# Altium schematic sheet Модуль MMI.SchDoc
size 209 x 297 mm; DocumentNumber: 6; SheetNumber: 6; SheetTotal: 11; ListNumber: 1
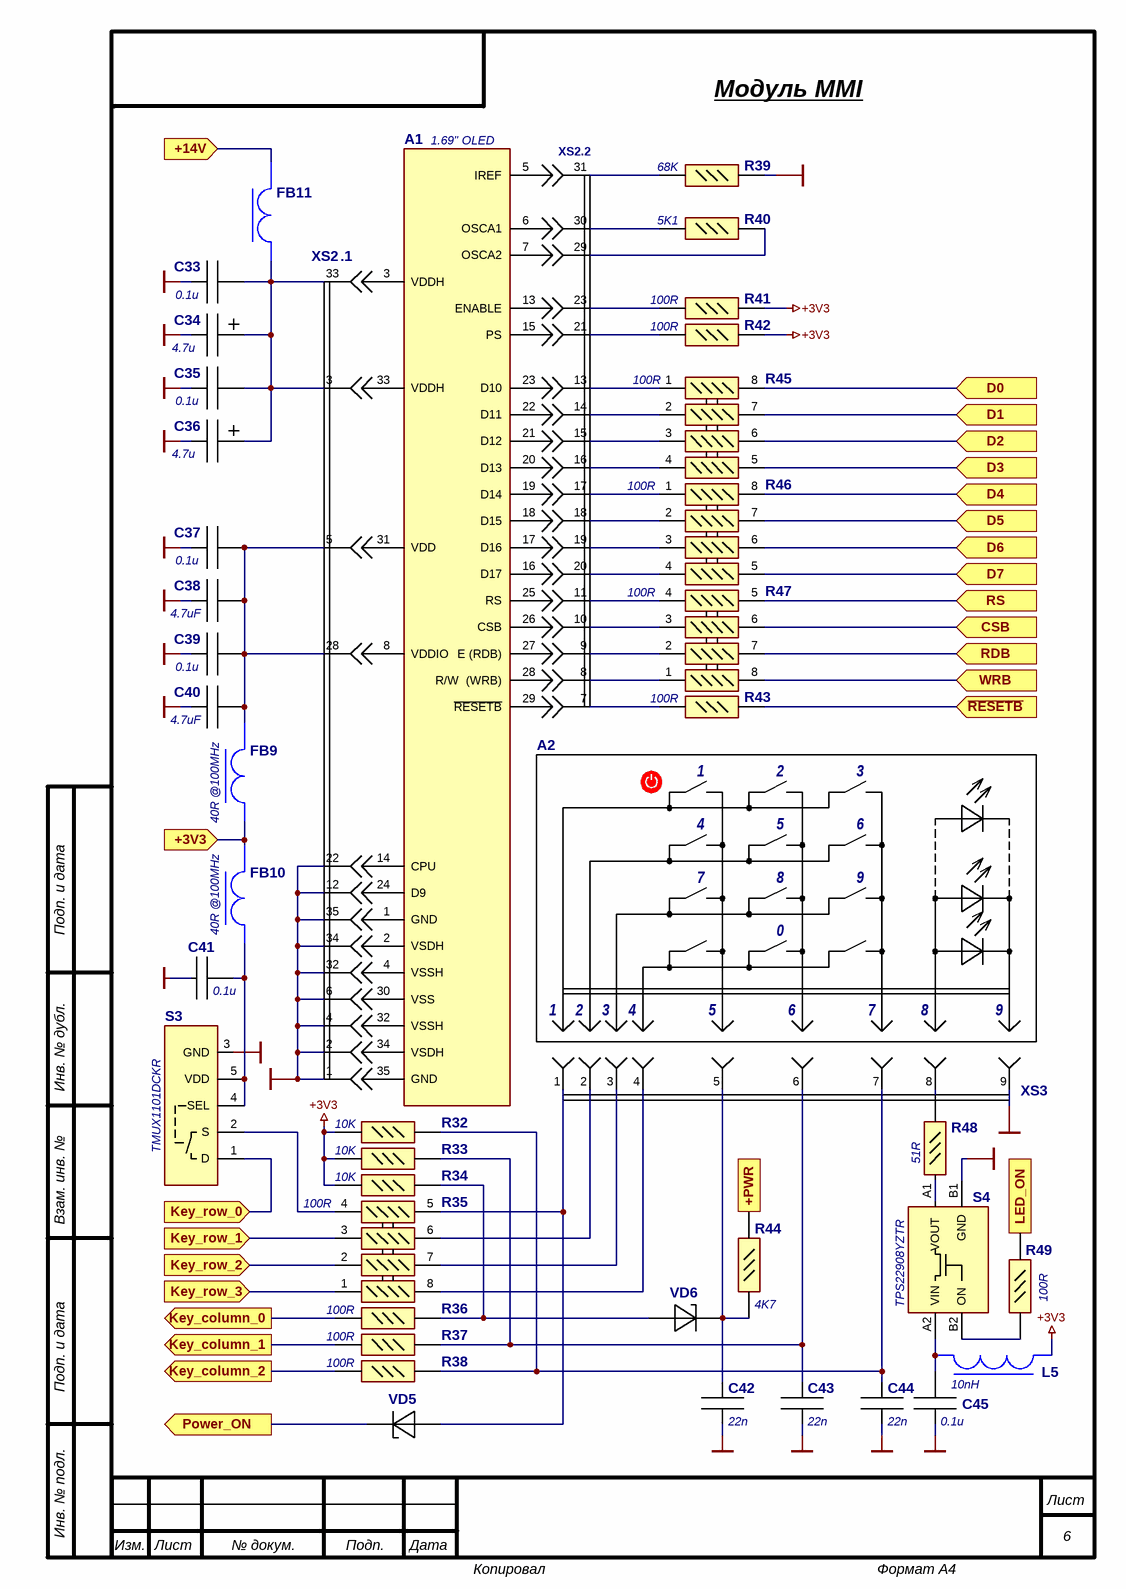
[diagram p0: Модуль MMI.SchDoc]

## Parts
A1  1.69" OLED
A2  (no value)
C33  0.1u  [:CAP0402 100x50x50]
C34  4.7u  [:CAP1206 C3216-18]
C35  0.1u  [:CAP0402 100x50x50]
C36  4.7u  [:CAP1206 C3216-18]
C37  0.1u  [:CAP0402 100x50x50]
C38  4.7uF  [:CAP0805 C2012X125]
C39  0.1u  [:CAP0402 100x50x50]
C40  4.7uF  [:CAP0805 C2012X125]
C41  0.1u  [:CAP0402 100x50x50]
C42  22n  [:CAP0402 100x50x50]
C43  22n  [:CAP0402 100x50x50]
C44  22n  [:CAP0402 100x50x50]
C45  0.1u  [:CAP0402 100x50x50]
FB9  40R @100MHz  [:FER MMZ1005Y400CTD25]
FB10  40R @100MHz  [:FER MMZ1005Y400CTD25]
FB11  40R @100MHz  [:FER MMZ1005Y400CTD25]  (value not drawn)
L5  10nH  [:IND 0402]
R32  Manufacturer_Part_Number (part 2: value): 10K  [:RES0402]  (hidden comment: RC0402FR-07)
R33  Manufacturer_Part_Number (part 2: value): 10K  [:RES0402]  (hidden comment: RC0402FR-07)
R34  Manufacturer_Part_Number (part 2: value): 10K  [:RES0402]  (hidden comment: RC0402FR-07)
R35  100R  [:RES0402x4]
R36  Manufacturer_Part_Number (part 2: value): 100R  [:RES0402]  (hidden comment: RC0402FR-07)
R37  Manufacturer_Part_Number (part 2: value): 100R  [:RES0402]  (hidden comment: RC0402FR-07)
R38  Manufacturer_Part_Number (part 2: value): 100R  [:RES0402]  (hidden comment: RC0402FR-07)
R39  Manufacturer_Part_Number (part 2: value): 68K  [:RES0402]  (hidden comment: RC0402FR-07)
R40  Manufacturer_Part_Number (part 2: value): 5K1  [:RES0402]  (hidden comment: RC0402FR-07)
R41  Manufacturer_Part_Number (part 2: value): 100R  [:RES0402]  (hidden comment: RC0402FR-07)
R42  Manufacturer_Part_Number (part 2: value): 100R  [:RES0402]  (hidden comment: RC0402FR-07)
R43  Manufacturer_Part_Number (part 2: value): 100R  [:RES0402]  (hidden comment: RC0402FR-07)
R44  Manufacturer_Part_Number (part 2: value): 4K7  [:RES0402]  (hidden comment: RC0402FR-07)
R45  100R  [:RES0402x4]
R46  100R  [:RES0402x4]
R47  100R  [:RES0402x4]
R48  Manufacturer_Part_Number (part 2: value): 51R  [:RES0402]  (hidden comment: RC0402FR-07)
R49  Manufacturer_Part_Number (part 2: value): 100R  [:RES0402]  (hidden comment: RC0402FR-07)
S3  TMUX1101DCKR  [:SC70 (5) P200X125X10]
S4  TPS22908YZTR  [:BGA4 P90X90X50]
VD5  30V 0.1A  [:DIODE SOD-923F]  (value not drawn)
VD6  30V 0.1A  [:DIODE SOD-923F]  (value not drawn)
XS2  0541043531  [541043531]  (value not drawn)
XS3  XF3M-0915-1B  [:CON XF3M-0915-1B]  (value not drawn)

## Ports
+3V3 (in), +14V (in), +PWR (in), CSB (in), D0 (in), D1 (in), D2 (in), D3 (in), D4 (in), D5 (in), D6 (in), D7 (in), Key_column_0 (out), Key_column_1 (out), Key_column_2 (out), Key_row_0 (in), Key_row_1 (in), Key_row_2 (in), Key_row_3 (in), LED_ON (in), Power_ON (out), RDB (in), RS (in), WRB (in), ~{RESETB} (in)

## Nets
+3V3: L5.2 R32.2 R33.2 R34.2 R41.2 R42.2
GND: C33.1 C34.2 C35.1 C36.2 C37.1 C38.2 C39.1 C40.2 C41.1 C42.1 C43.1 C44.1 C45.2 R39.2 S3.3(GND) S4.B1(GND) XS2.1 XS2.2 XS2.4 XS2.6 XS2.12 XS2.22 XS2.32 XS2.34 XS2.35 XS3.9
+3V3: FB9.1 FB10.2 ; port +3V3  [a separate net that carries the same name]
+14V: FB11.2 ; port +14V
+PWR: R44.1 ; port +PWR
CSB: R47.6 ; port CSB
D0: R45.8 ; port D0
D1: R45.7 ; port D1
D2: R45.6 ; port D2
D3: R45.5 ; port D3
D4: R46.8 ; port D4
D5: R46.7 ; port D5
D6: R46.6 ; port D6
D7: R46.5 ; port D7
Key_column_0: R36.1 ; port Key_column_0
Key_column_1: R37.1 ; port Key_column_1
Key_column_2: R38.1 ; port Key_column_2
Key_row_0: S3.1(D) ; port Key_row_0
Key_row_1: R35.3 ; port Key_row_1
Key_row_2: R35.2 ; port Key_row_2
Key_row_3: R35.1 ; port Key_row_3
LED_ON: R49.1 ; port LED_ON
Power_ON: VD5.1(K) ; port Power_ON
~{RESETB}: R43.2 ; port ~{RESETB}
RDB: R47.7 ; port RDB
RS: R47.5 ; port RS
WRB: R47.8 ; port WRB
NetC33_2: C33.2 C34.1(+) C35.2 C36.1(+) FB11.1 XS2.3 XS2.33
NetC37_2: C37.2 C38.1 C39.2 C40.1 FB9.2 XS2.5 XS2.28
NetC41_2: C41.2 FB10.1 S3.4(SEL) S3.5(VDD)
NetC42_2: C42.2 R44.2 VD6.1(K) XS3.5
NetC43_2: C43.2 R33.1 R37.2 XS3.6
NetC44_2: C44.2 R32.1 R38.2 XS3.7
NetC45_1: C45.1 L5.1 S4.A2(VIN)
NetR34_1: R34.1 R36.2 VD6.2(A)
NetR35_4: R35.4 S3.2(S)
NetR35_5: R35.5 VD5.2(A) XS3.1
NetR35_6: R35.6 XS3.2(ч)
NetR35_7: R35.7 XS3.3
NetR35_8: R35.8 XS3.4
NetR39_1: R39.1 XS2.31
NetR40_1: R40.1 XS2.30
NetR40_2: R40.2 XS2.29
NetR41_1: R41.1 XS2.23
NetR42_1: R42.1 XS2.21
NetR43_1: R43.1 XS2.7
NetR45_1: R45.1 XS2.13
NetR45_2: R45.2 XS2.14
NetR45_3: R45.3 XS2.15
NetR45_4: R45.4 XS2.16
NetR46_1: R46.1 XS2.17
NetR46_2: R46.2 XS2.18
NetR46_3: R46.3 XS2.19
NetR46_4: R46.4 XS2.20
NetR47_1: R47.1 XS2.8
NetR47_2: R47.2 XS2.9
NetR47_3: R47.3 XS2.10
NetR47_4: R47.4 XS2.11
NetR48_1: R48.1 XS3.8
NetR48_2: R48.2 S4.A1(VOUT)
NetR49_2: R49.2 S4.B2(ON)

Not connected (* = marked no-connect by the designer): A1 1(GND) 2(VSDH) 3(VDDH) 4(VSSH) 5(IREF) 6(OSCA1) 7(OSCA2) 8(VDDIO) 13(ENABLE) 14(CPU) 15(PS) 16(D17) 17(D16) 18(D15) 19(D14) 20(D13) 21(D12) 22(D11) 23(D10) 24(D9) 25(RS) 26(CSB) 27(E_(RDB)) 28(R/W__(WRB)) 29(~{RESETB}) 30(VSS) 31(VDD) 32(VSSH) 33(VDDH) 34(VSDH) 35(GND)

## Notes on the sheet
- Модуль MMI
- (near XS2) XS2.2
- (near XS2) .1
- Подп. и дата
- Инв. № дубл.
- Взам. инв. №
- Инв. № подл.
- Лист
- Изм.
- № докум.
- Подп.
- Дата
- Копировал
- Формат А4
- (in symbol Клавиатура 3x4 (Заказ №...)) 1; 2; 3; 4; 5; 6; 7; 8; 9; 0

## Library data of the parts
A1 = NHD-1.69-160128G: Graphic LCD Display Module Transflective (RGB) / OLED Parallel, Serial 1.69" (42.93mm) 160 x 128; Manufacturer_Name: Newhaven Display; Manufacturer_Part_Number: NHD-1.69-160128G; Short Description: 1.69" OLED
A2 = Клавиатура 3x4 (Заказ №...): Клавиатура мембранная с подсветкой / Для серии будем заказывать изгтовление клавиатуры с подсветко по нашему ТЗ.; Manufacturer_Name: ООО «ИНЕЛСО»; Manufacturer_Part_Number: Клавиатура 5042 ТЕИЯ.464511.002 ТЗ
C33 C35 C37 C39 C41 C45 = GRM155R71E104KE14J: ±10% 25V Ceramic Capacitor X7R 0402 (1005 Metric); Manufacturer_Name: Murata Electronics; Short Description: 0402 0.1uF 25V; Datasheet Link: http://www.murata.com/~/media/webrenewal/support/library/catalog/products/capacitor/mlcc/c02e.pdf; Height: 0.55mm; Manufacturer_Part_Number: GRM155R71E104KE14J; Mouser Part Number: 81-GRM155R71E104KE4J; Mouser Price/Stock: https://www.mouser.co.uk/ProductDetail/Murata-Electronics/GRM155R71E104KE14J?qs=hNud%2FORuBR2EQtvG2InwAQ%3D%3D; Arrow Part Number: GRM155R71E104KE14J; Arrow Price/Stock: https://www.arrow.com/en/products/grm155r71e104ke14j/murata-manufacturing
C34 C36 = T491A475K025AT: 4.7µF Molded Tantalum Capacitors 25V 1206 (3216 Metric) 50mOhm; Manufacturer_Name: KEMET; Short Description: 1206 4.7µF 25V; Manufacturer_Part_Number: T491A475K025AT
C38 C40 = GRM21BZ71E475KE15L: CAP CER 4.7uF 25V X7R 0805; Manufacturer_Name: Murata Electronics; Short Description: 0805 4.7uF 25V; Datasheet Link: https://search.murata.co.jp/Ceramy/image/img/A01X/G101/ENG/GRM21BZ71E475KE15-01.pdf; Height: 1.45mm; Manufacturer_Part_Number: GRM21BZ71E475KE15L
C42-C44 = GCM155R71E223KA55D: CAP CER  25V X7R 0402; Manufacturer_Name: Murata Electronics; Short Description: 0402 22n 25V; Manufacturer_Part_Number: GCM155R71E223KA55D
FB9-FB11 = MMZ1005Y400CTD25: 40 Ohms @ 100MHz 1 Signal Line Ferrite Bead 0402 (1005 Metric) 550mA 100mOhm; Manufacturer_Name: TDK; Short Description: 0402 40R @100MHz; Datasheet Link: https://www.arrow.com/en/products/mmz1005y400ctd25/tdk; Height: 0.55mm; Manufacturer_Part_Number: MMZ1005Y400CTD25; Mouser Part Number: 810-MMZ1005Y400CTD25; Mouser Price/Stock: https://www.mouser.com/Search/Refine.aspx?Keyword=810-MMZ1005Y400CTD25; Arrow Part Number: MMZ1005Y400CTD25; Arrow Price/Stock: https://www.arrow.com/en/products/mmz1005y400ctd25/tdk
L5 = LQG15HN10NJ02D: Unshielded Multilayer Inductor 0402 5%; Manufacturer_Name: Murata Electronics; Short Description: 10nH 500mA 0.29Ohm; Manufacturer_Part_Number: LQG15HN10NJ02D
R32-R34 R36-R44 R48 R49 = RC0402FR-07: Resistor 0402 1% 1/16W / Value Range: 1Ω ... 10 MΩ / Value Example: / 0R = 0Ω / 97R6 = 97.6Ω / 9K76 = 9760Ω / 1M = 1,000,000Ω; Manufacturer_Name: YAGEO; Manufacturer_Part_Number (part 3: after value): L; Short Description: 0402 1%; Datasheet Link: http://www.yageo.com/documents/recent/PYu-RC0402_51_RoHS_L_6_r.pdf; Height: 0.4mm; Manufacturer_Part_Number: RC0402FR-07; Parameter 1: *
R35 R45-R47 = EXB-N8V101JX: 100 Ohm ±5% 31mW Power Per Element Isolated 4 Resistor Network/Array ±200ppm/°C 0804, Concave, Long Side Terminals; Manufacturer_Name: Panasonic; Short Description: 0804 5% 100R; Datasheet Link: https://industrial.panasonic.com/cdbs/www-data/pdf/AOC0000/AOC0000C14.pdf; Height: 0.55mm; Manufacturer_Part_Number: EXB-N8V101JX; Mouser Part Number: 667-EXB-N8V101JX; Mouser Price/Stock: https://www.mouser.co.uk/ProductDetail/Panasonic/EXB-N8V101JX?qs=cttFivMKqWxyXyoXALoehw%3D%3D; Arrow Part Number: EXB-N8V101JX; Arrow Price/Stock: https://www.arrow.com/en/products/exbn8v101jx/panasonic
S3 = TMUX1101DCKR: SPST Switch Bidir. 1.8 Ω 30mA 300MHz; Manufacturer_Name: Texas Instruments; Datasheet Link: http://www.ti.com/lit/gpn/TMUX1101; Height: 1.1mm; Manufacturer_Part_Number: TMUX1101DCKR; Mouser Part Number: 595-TMUX1101DCKR; Mouser Price/Stock: https://www.mouser.co.uk/ProductDetail/Texas-Instruments/TMUX1101DCKR?qs=vLWxofP3U2x5rBu7DSMCxw%3D%3D; Arrow Part Number: TMUX1101DCKR; Arrow Price/Stock: https://www.arrow.com/en/products/tmux1101dckr/texas-instruments
S4 = TPS22908YZTR: SPST Switch 3.6-V, 1-A, 28-mΩ; Manufacturer_Name: Texas Instruments; Datasheet Link: http://www.ti.com/lit/gpn/tps22908; Height: 0.625mm; Manufacturer_Part_Number: TPS22908YZTR; Mouser Part Number: 595-TPS22908YZTR; Mouser Price/Stock: https://www.mouser.co.uk/ProductDetail/Texas-Instruments/TPS22908YZTR?qs=4whTb%2F0XQMjgQyC%252BYmbgaA%3D%3D; Arrow Part Number: TPS22908YZTR; Arrow Price/Stock: https://www.arrow.com/en/products/tps22908yztr/texas-instruments
VD5 VD6 = CDBQR0130R: Diodes Schottky 0402 30V 0.1A; Manufacturer_Name: Comchip Technology; Datasheet Link: http://www.comchiptech.com/admin/files/product/CDBQR0130R-HF-RevC796140.pdf; Height: 0.55mm; Manufacturer_Part_Number: CDBQR0130R; Mouser Part Number: 750-CDBQR0130R; Mouser Price/Stock: https://www.mouser.co.uk/ProductDetail/Comchip-Technology/CDBQR0130R?qs=tw%252BuQ%2FB6PO3SSBtQ52w%2FCg%3D%3D; Arrow Part Number: CDBQR0130R; Arrow Price/Stock: https://www.arrow.com/en/products/cdbqr0130r/comchip-technology; Short Description: 0402 30V 0.1A
XS2 = 0541043531: Rotary Backlock Connector 35-pin 0.5mm Pitch, Top side Contact; Manufacturer_Name: Molex; Datasheet Link: https://componentsearchengine.com//54104-3531.pdf; Height: 2mm; Manufacturer_Part_Number: 0541043531; Short Description: 35-pin 0.5mm; Mouser2 Part Number: 538-54104-3531; Mouser2 Price/Stock: https://www.mouser.com/Search/Refine.aspx?Keyword=538-54104-3531
XS3 = XF3M-0915-1B: Rotary Backlock Connector 35-pin 0.5mm Pitch, Dual sided Contact; Manufacturer_Name: OMRON; Short Description: 9-pin 0.5mm; Manufacturer_Part_Number: XF3M-0915-1B